# EAGLE design EBN_FMRX_V02 (EAGLE 7.3.0)
CNAME: EasyBoard Nano; CREVISION: 0.1; DESIGNER: Martin Olejar
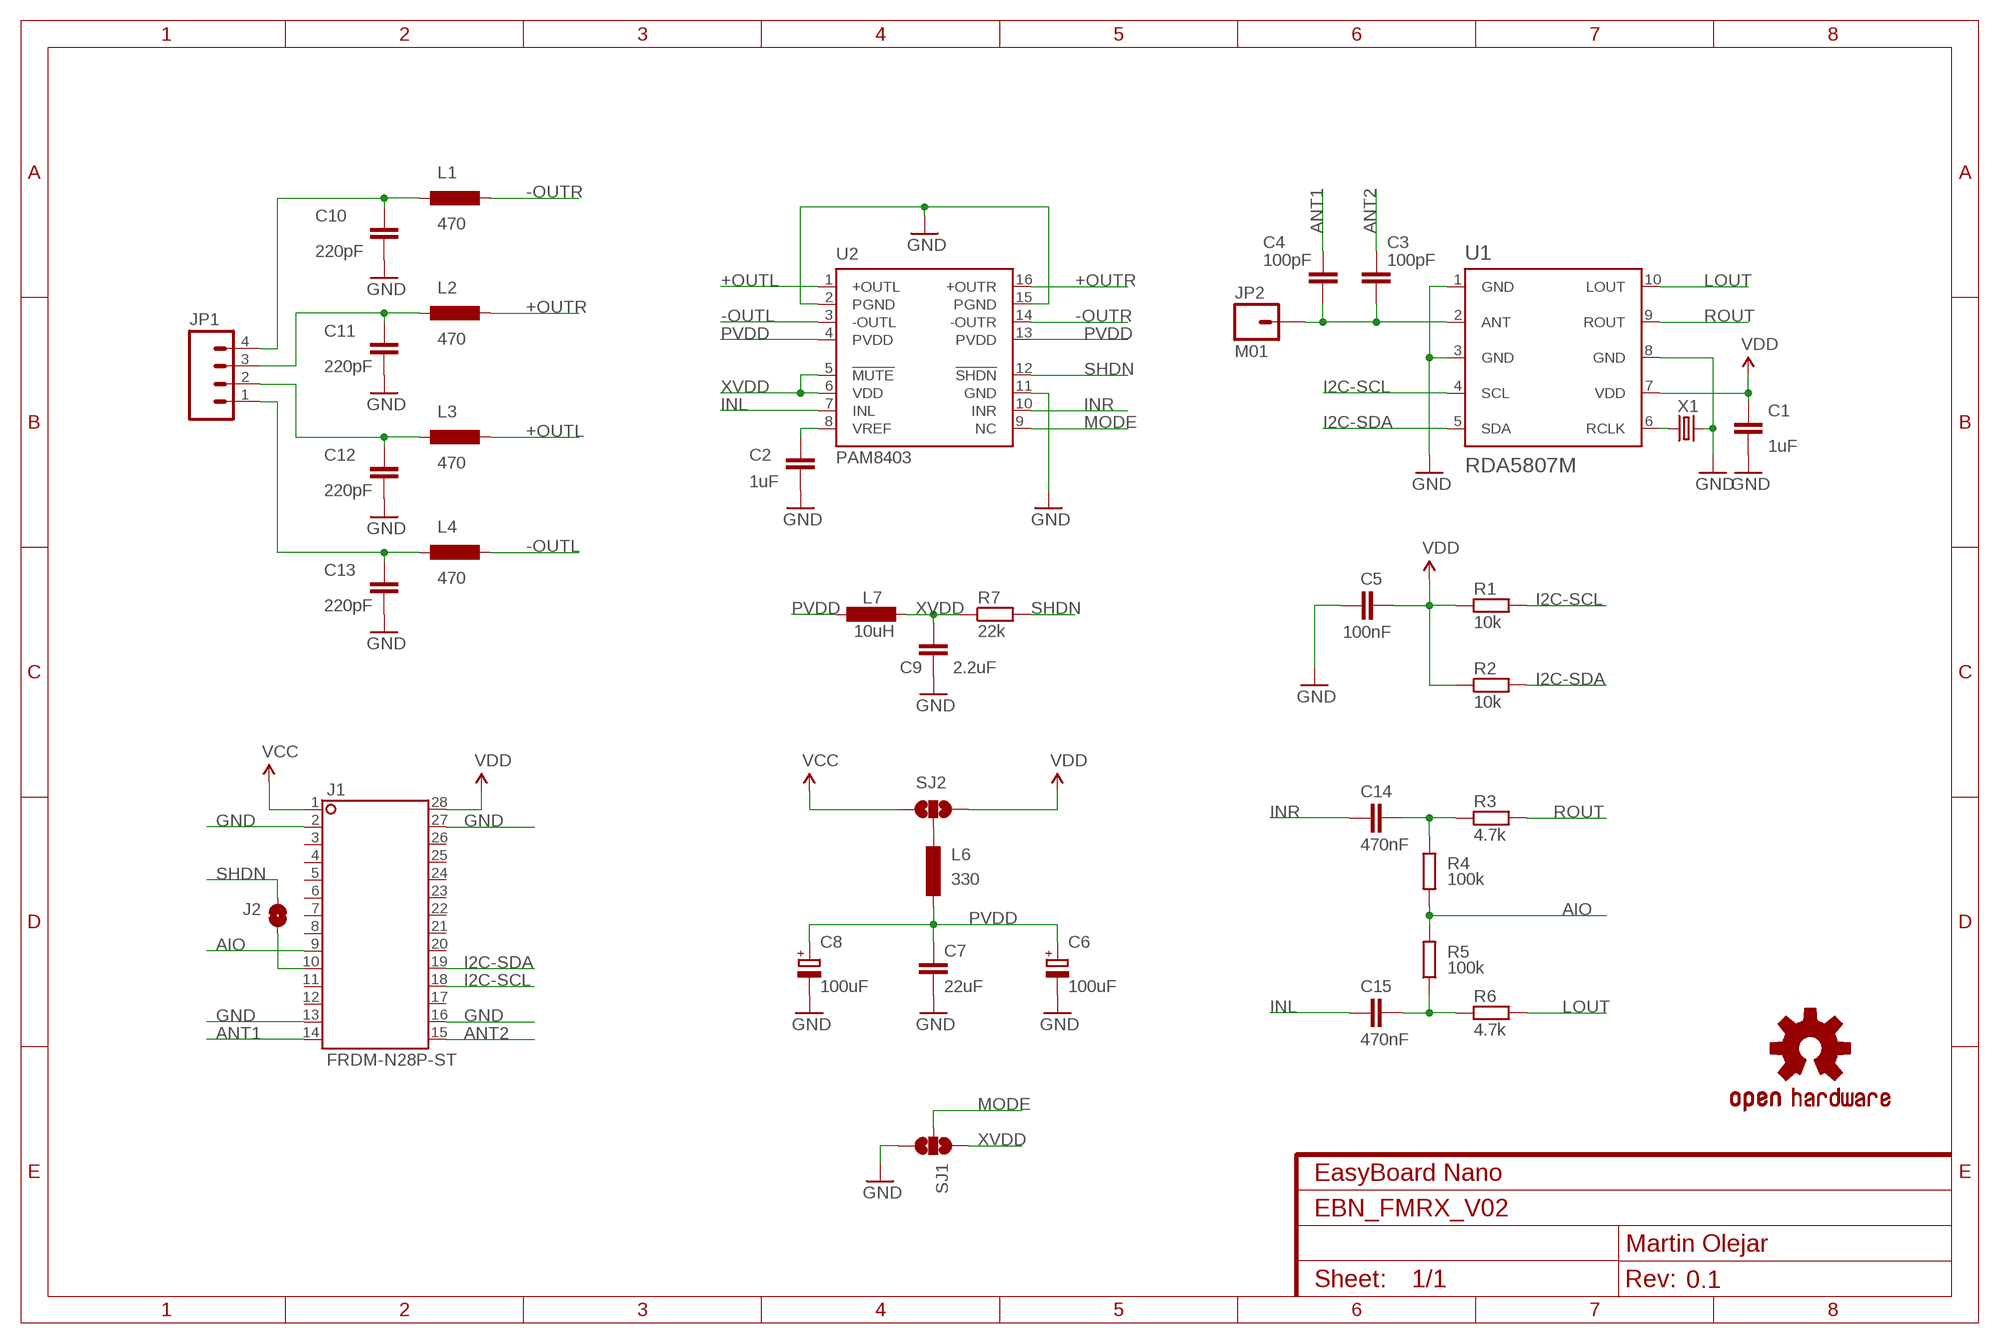
[diagram p0: schematic, sheet 1]

## Parts
C1  1uF  C-EUC0603  [C0603]
C2  1uF  C-EUC0603  [C0603]
C3  100pF  C-EUC0603  [C0603]
C4  100pF  C-EUC0603  [C0603]
C5  100nF  C-EUC0603  [C0603]
C6  100uF  CPOL-EUSMCC  [SMC_C]
C7  22uF  C-EUC1206  [C1206]
C8  100uF  CPOL-EUSMCC  [SMC_C]
C9  2.2uF  C-EUC0603  [C0603]
C10  220pF  C-EUC0603  [C0603]
C11  220pF  C-EUC0603  [C0603]
C12  220pF  C-EUC0603  [C0603]
C13  220pF  C-EUC0603  [C0603]
C14  470nF  C-EUC0603  [C0603]
C15  470nF  C-EUC0603  [C0603]
J1  FRDM-N28P-ST  [FRDM-N28P-SHIELD]
J2  SJ-S  [JUMPER-SMD-S1X]
JP1  M04SMD_1.25MM  [1X04-1.25MM_SMD]
JP2  M01  [1X01-EXTRA]
L1  470  L-EUL0805  [L0805]
L2  470  L-EUL0805  [L0805]
L3  470  L-EUL0805  [L0805]
L4  470  L-EUL0805  [L0805]
L6  330  L-EUL0805  [L0805]
L7  10uH  L-EUL0805  [L0805]
LOGO1  OSHW-LOGOS  [OSHW-LOGO-S]
R1  10k  R-EUR0603  [R0603]
R2  10k  R-EUR0603  [R0603]
R3  4.7k  R-EUR0603  [R0603]
R4  100k  R-EUR0603  [R0603]
R5  100k  R-EUR0603  [R0603]
R6  4.7k  R-EUR0603  [R0603]
R7  22k  R-EUR0603  [R0603]
SJ1  SJ2W-S  [JUMPER-SMD-S2X]
SJ2  SJ2W-S  [JUMPER-SMD-S2X]
U1  RDA5807M  [MSOP10]
U2  PAM8403  [SO16]
X1  XTAL1-SMD-2P-3.2X1.5MM  [SMD-2X-3215]

## Nets
+OUTL: L3.2 U2.1(+OUTL)
+OUTR: L2.2 U2.16(+OUTR)
-OUTL: L4.2 U2.3(-OUTL)
-OUTR: L1.2 U2.14(-OUTR)
AIO: J1.9 R4.2 R5.2
ANT1: C4.1 J1.14
ANT2: C3.1 J1.15
GND: C1.1 C2.2 C5.2 C6.- C7.1 C8.- C9.1 C10.1 C11.1 C12.1 C13.1 J1.2 J1.13 J1.16 J1.27 SJ1.3 U1.1(GND) U1.3(GND) U1.8(GND) U2.2(PGND) U2.11(GND) U2.15(PGND) X1.2
I2C-SCL: J1.18 R1.2 U1.4(SCL)
I2C-SDA: J1.19 R2.2 U1.5(SDA)
INL: C15.2 U2.7(INL)
INR: C14.2 U2.10(INR)
LOUT: R6.2 U1.10(LOUT)
MODE: SJ1.2 U2.9(NC)
N$1: C2.1 U2.8(VREF)
N$2: C10.2 JP1.4 L1.1
N$3: C3.2 C4.2 JP2.P$1 U1.2(ANT)
N$4: C11.2 JP1.3 L2.1
N$5: C12.2 JP1.2 L3.1
N$6: U1.6(RCLK) X1.1
N$7: J1.10 J2.1
N$9: C13.2 JP1.1 L4.1
N$11: L6.2 SJ2.2
N$16: C14.1 R3.1 R4.1
N$17: C15.1 R5.1 R6.1
PVDD: C6.+ C7.2 C8.+ L6.1 L7.1 U2.4(PVDD) U2.13(PVDD)
ROUT: R3.2 U1.9(ROUT)
SHDN: J2.2 R7.2 U2.12(!SHDN)
VCC: J1.1 SJ2.1
VDD: C1.2 C5.1 J1.28 R1.1 R2.1 SJ2.3 U1.7(VDD)
XVDD: C9.2 L7.2 R7.1 SJ1.1 U2.5(!MUTE) U2.6(VDD)
Unconnected: J1.3 J1.4 J1.5 J1.6 J1.7 J1.8 J1.11 J1.12 J1.17 J1.20 J1.21 J1.22 J1.23 J1.24 J1.25 J1.26

## Library data of the parts
C1-C5 C7 C9-C15 = atomx_RLC:C-EU: CAPACITOR, European symbol
C6 C8 = atomx_RLC:CPOL-EU: POLARIZED CAPACITOR, European symbol
J1 = atomx_Boards:FRDM-N28P: Dual In Line
J2 = atomx_Connectors:SJ: SMD solder JUMPER
JP1 = atomx_Connectors:M04: Header 4 Standard 4-pin 0.1" header. Use with straight break away headers (SKU : PRT-00116), right angle break away headers (PRT-00553), swiss pins (PRT-00743), machine pins (PRT-00117), and female headers (PRT-00115). Molex polarized connector foot print use with SKU : PRT-08231 with associated crimp pins and housings. 1MM SMD Version SKU: PRT-10208
JP2 = atomx_Connectors:M01: Header 1 Standard 1-pin 0.1" header. Use with straight break away headers (SKU : PRT-00116), right angle break away headers (PRT-00553), swiss pins (PRT-00743), machine pins (PRT-00117), and female headers (PRT-00115).
L1-L4 L6 L7 = atomx_RLC:L-EU: INDUCTOR, European symbol
LOGO1 = atomx_Common:OSHW-LOGO: Open Source Hardware Logo This logo indicates the piece of hardware it is found on incorporates a OSHW license and/or adheres to the definition of open source hardware found here: http://freedomdefined.org/OSHW
R1-R7 = atomx_RLC:R-EU: RESISTOR, European symbol
SJ1 SJ2 = atomx_Connectors:SJ2W: SMD solder JUMPER
U1 = atomx_IC:RDA5807M
U2 = atomx_IC:PAM8403
X1 = atomx_Xtals:XTAL1

## Board
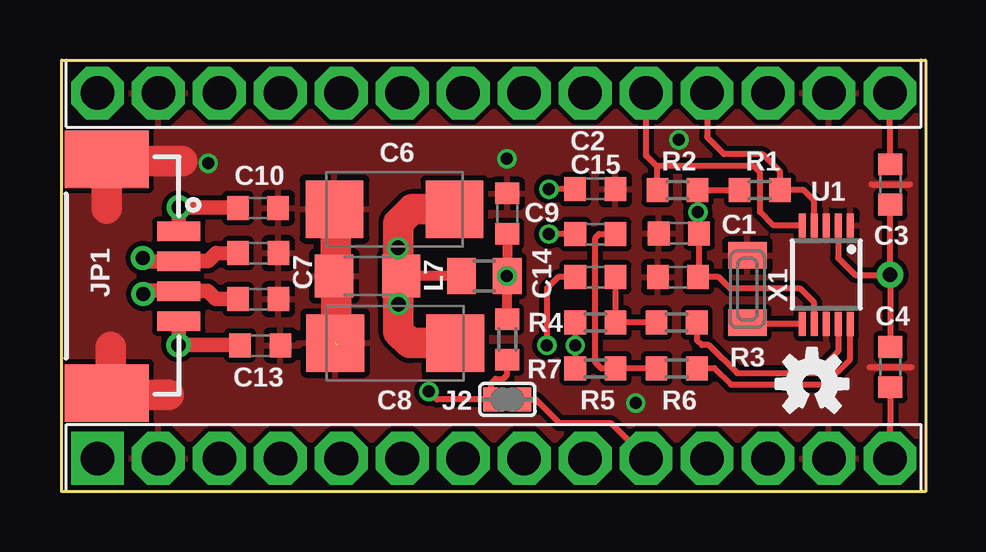
[diagram p1: board, top side]
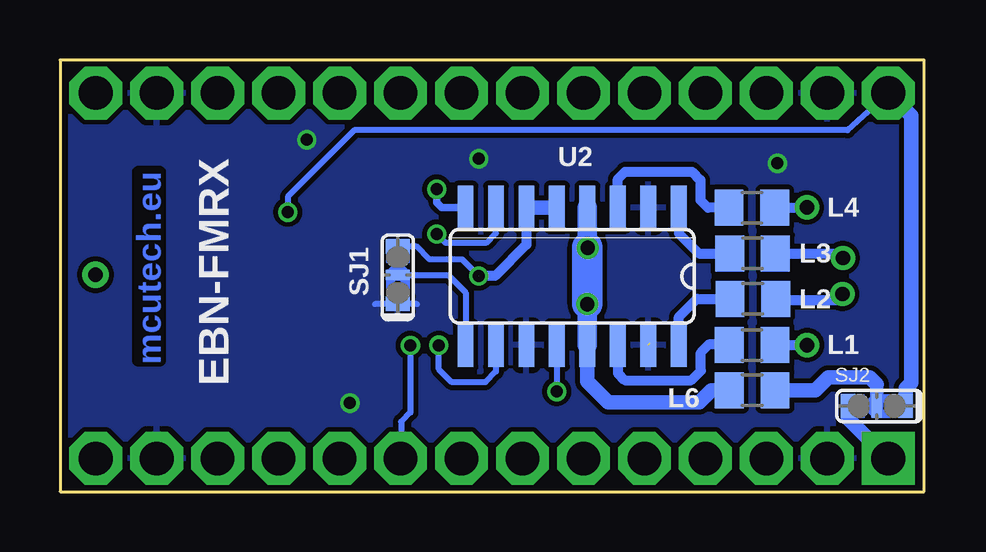
[diagram p2: board, bottom side, seen from below]

Size 36 x 18 mm. Coordinates in mm from the lower left corner, seen from the top.
Copper layers (1*16): Top 0.035mm / dielectric 1.5mm / Bottom 0.035mm
Design rules "ITEADstudio_DRC *": minimum track width 6mil, minimum drill 12mil, track to track 8mil, track to pad 8mil, pad to pad 8mil, via to via 8mil, smd to smd 0mil, copper to edge 10mil, drill to drill 10mil, minimum pad ring 10mil, minimum via ring 6mil, stop-mask expansion 2mil, vias tented up to drill 100mil, thermal gap 10mil

### Footprints (pad centres in the part's own frame; a part is rotated, then mirrored left to right if it is on the bottom)
C0603 = smd 0.9 x 1: 1 -0.84,0; 2 0.84,0
SMC_C = smd 2.4 x 2.4: + -2.5,0; - 2.5,0
C1206 = smd 1.6 x 1.8: 1 -1.4,0; 2 1.4,0
FRDM-N28P-SHIELD = drill 1.4 pad 2.2 square: 1 -16.51,-7.62 | drill 1.4 pad 2.2 octagon: 2 -13.97,-7.62; 3 -11.43,-7.62; 4 -8.89,-7.62; 5 -6.35,-7.62; 6 -3.81,-7.62; 7 -1.27,-7.62; 8 1.27,-7.62; 9 3.81,-7.62; 10 6.35,-7.62; 11 8.89,-7.62; 12 11.43,-7.62; 13 13.97,-7.62; 14 16.51,-7.62; 15 16.51,7.62; 16 13.97,7.62; 17 11.43,7.62; 18 8.89,7.62; 19 6.35,7.62; 20 3.81,7.62; 21 1.27,7.62; 22 -1.27,7.62; 23 -3.81,7.62; 24 -6.35,7.62; 25 -8.89,7.62; 26 -11.43,7.62; 27 -13.97,7.62; 28 -16.51,7.62
JUMPER-SMD-S1X = smd 0.6 x 1: 1 -0.7,0; 2 0.7,0
1X04-1.25MM_SMD = smd 0.8 x 1.8: 1 0,0; 2 1.25,0; 3 2.5,0; 4 3.75,0 | smd 2.4 x 3.5: P$5 -3,-3; P$6 6.75,-3
1X01-EXTRA = drill 0.6: P$1 0,0
L0805 = smd 1.2 x 1.5: 1 -0.95,0; 2 0.95,0
R0603 = smd 0.9 x 1: 1 -0.84,0; 2 0.84,0
JUMPER-SMD-S2X = smd 0.6 x 1: 1 -1.2,0; 3 1.2,0 | smd 0.4 x 1: 2 0,0
MSOP10 = smd 0.3 x 1: 1 -1,-2.05; 2 -0.5,-2.05; 3 0,-2.05; 4 0.5,-2.05; 5 1,-2.05; 6 1,2.05; 7 0.5,2.05; 8 0,2.05; 9 -0.5,2.05; 10 -1,2.05
SO16 = smd 0.66 x 1.8: 1 -4.445,-2.873; 2 -3.175,-2.873; 3 -1.905,-2.873; 4 -0.635,-2.873; 5 0.635,-2.873; 6 1.905,-2.873; 7 3.175,-2.873; 8 4.445,-2.873; 9 4.445,2.873; 10 3.175,2.873; 11 1.905,2.873; 12 0.635,2.873; 13 -0.635,2.873; 14 -1.905,2.873; 15 -3.175,2.873; 16 -4.445,2.873
SMD-2X-3215 = smd 1.1 x 1.6: 1 -1.4,0; 2 1.4,0

### Placement (x,y rotation side)
C1  25.72,10.77 0 top
C2  22.23,12.61 0 top
C3  34.53,12.81 270 top
C4  34.53,5.19 90 top
C5  25.68,8.94 180 top
C6  13.87,11.78 180 top
C7  12.75,8.99 0 top
C8  13.9,6.19 180 top
C9  18.56,11.59 270 top
C10  8.27,6.1 180 top
C11  8.19,8.03 180 top
C12  8.19,9.94 180 top
C13  8.18,11.83 180 top
C14  22.24,8.94 180 top
C15  22.24,10.73 180 top
J1  18,9 0 top
J2  18.57,3.84 180 top
JP1  4.88,10.86 270 top
JP2  34.52,9.04 0 top
L1  7.16,6.11 180 bottom
L2  7.13,8.04 180 bottom
L3  7.14,9.93 180 bottom
L4  7.17,11.84 180 bottom
L6  7.16,4.22 0 bottom
L7  17.61,8.99 0 top
LOGO1  31.26,4.49 0 top
R1  29.09,12.58 0 top
R2  25.66,12.58 180 top
R3  25.62,7.05 0 top
R4  22.24,7.05 180 top
R5  22.24,5.14 180 top
R6  25.63,5.14 0 top
R7  18.56,6.34 270 top
SJ1  21.92,9.03 270 bottom
SJ2  1.97,3.57 0 bottom
U1  31.86,9.05 180 top
U2  14.66,8.98 180 bottom
X1  28.57,8.45 90 top

### Tracks (layer width: path | path; a pad name or v marks a point on that pad's centre or on a via)
+OUTL
  Bottom 0.406: U2.1 10.21,10.77 9.38,9.93 L3.2
+OUTR
  Bottom 0.406: 8.27,8.01 L2.2 9.46,8.04 10.21,7.29 U2.16
-OUTL
  Bottom 0.406: U2.3 12.75,13.04 12.45,13.34 9.66,13.34 9.32,13 9.32,12.15 9.01,11.84 8.22,11.84 L4.2
-OUTR
  Bottom 0.406: U2.14 12.75,4.95 12.46,4.64 9.7,4.64 9.3,5.04 9.3,5.8 8.97,6.13 8.22,6.13 L1.2
AIO  (via drill 0.5)
  Top 0.254: R4.2 21.4,6.13 v21.4,6.09 R5.2
  Bottom 0.254: v21.4,6.09 21.4,3.3 21.79,2.91 21.79,1.4 J1.9
ANT1
  Top 0.254: C4.1 J1.14
ANT2
  Top 0.254: C3.1 J1.15
GND  (via drill 0.5)  (1 unrouted)
  Top 0.254: 33.65,5.19 35.4,5.19 | 33.75,12.81 35.34,12.81 35.34,12.82
  Top 0.813: 4.47,4.03 4.47,4.04 | 2.11,4.13 2.05,4.13 | 1.86,14.13 1.88,14.13
  Top 1.27: 1.94,4.03 4.47,4.03 | 2.05,4.13 2.05,6.03 | 1.88,14.13 1.88,11.81 | 1.96,13.79 5.03,13.79 | 11.43,11.49 11.45,6.26
  Bottom 0.254: 21.13,7.82 22.87,7.82
  other vias: 23.92,3.69 6.11,13.69 25.72,14.67 18.55,13.88
  pour Top: 0.15,17.99 36.15,17.99 36.15,0.02 0.15,0.02
  pour Bottom: 0.15,17.98 36.02,17.98 36.02,0.02 0.15,0.02
I2C-SCL
  Top 0.254: U1.4 31.36,12.13 30.91,12.58 R1.2 29.94,13.34 29.21,14.07 27.61,14.07 26.89,14.79 J1.18
I2C-SDA
  Top 0.254: U1.5 29.65,11.1 29.1,11.65 29.1,13.3 28.83,13.57 24.79,13.57 | 24.95,12.72 R2.2 24.79,12.58 24.79,13.57 | 24.79,13.57 24.35,14.01 J1.19
INL  (via drill 0.5)
  Top 0.254: C15.2 v20.31,10.73 v20.3,10.74
  Bottom 0.254: U2.7 17.84,12.05 17.84,10.78 18.25,10.37 19.93,10.37 v20.3,10.74
INR  (via drill 0.5)
  Top 0.254: C14.2 20.69,8.94 20.22,8.47 v20.22,6.1
  Bottom 0.254: 17.84,5.91 U2.10 17.83,5 18.28,4.56 19.67,4.56 20.21,5.1 v20.21,6.09 v20.22,6.1
LOUT
  Top 0.254: U1.10 32.85,6.86 32.85,5.49 31.82,4.46 27.88,4.46 27.2,5.14 R6.2 26.49,5.16
MODE
  Bottom 0.254: SJ1.2 19.83,9.03 19.1,8.3 U2.9
N$1  (via drill 0.5)
  Top 0.254: C2.1 v20.3,12.61
  Bottom 0.305: U2.8 20.09,11.85 20.3,12.06 v20.3,12.61
N$2  (via drill 0.6 pad 1.02)
  Top 0.61: C10.2 7.41,6.11 v4.87,6.11 4.88,6.12 JP1.4
  Bottom 0.406: L1.1 v4.87,6.11
N$3
  Top 0.254: U1.2 32.36,9.74 33.06,9.04 JP2.P$1 | JP2.P$1 34.52,11.95 C3.2 | JP2.P$1 34.52,6.05 C4.2
N$4  (via drill 0.6 pad 1.02)
  Top 0.406: 5.07,8.38 JP1.3
  Top 0.61: 5.07,8.38 3.54,8.38 v3.4,8.24 | C11.2 7.33,8.04 6.41,8.04 6.09,8.36 JP1.3
  Bottom 0.406: L2.1 6.27,8 | 6.27,8 6.22,8.05 | 6.27,8 3.64,8 v3.4,8.24
N$5  (via drill 0.6 pad 1.02)
  Top 0.406: 5.07,9.59 JP1.2
  Top 0.61: 5.07,9.59 3.58,9.59 v3.38,9.74 | C12.2 7.33,9.93 6.43,9.94 6.11,9.62 JP1.2
  Bottom 0.406: L3.1 3.52,9.93 v3.38,9.74
N$6
  Top 0.254: U1.6 28.8,7 X1.1
N$7
  Top 0.254: J2.1 19.76,3.84 20.74,2.86 22.87,2.86 J1.10
N$9  (via drill 0.6 pad 1.02)
  Top 0.406: 5.01,10.9 JP1.1
  Top 0.61: C13.2 7.31,11.85 v4.88,11.85 4.88,11.03 5.01,10.9
  Bottom 0.406: L4.1 4.89,11.84 v4.88,11.85
N$11
  Bottom 0.56: 1.97,4.46 SJ2.2
  Bottom 0.61: L6.2 4.54,4.22 4,4.76 2.27,4.76 1.97,4.46
N$16
  Top 0.254: R3.1 R4.1 C14.1 23.09,8.76
N$17
  Top 0.254: C15.1 23.13,10.74 22.39,10.74 22.24,10.59 22.24,5.38 22.49,5.13 R5.1 R6.1
PVDD  (via drill 0.6)
  Top 0.254: 14.02,6.66 14.02,7.79 v14.03,7.82
  Top 0.406: L7.1 C7.2
  Top 1.016: 14.02,9.12 C7.2 14.02,8.87
  Top 1.27: C6.+ 14.6,11.78 14.02,11.2 14.02,9.12 | C8.+ 14.5,6.19 14.02,6.66 14.02,8.87
  Bottom 0.406: 14.02,10.21 v14.01,10.16 14.03,10.2 | 14.02,7.78 v14.03,7.82 | 14.03,5.9 U2.13
  Bottom 0.61: 14.03,5.9 14.03,4.59 13.16,3.72 9.36,3.72 8.86,4.22 L6.1
  Bottom 0.813: U2.4 14.02,10.21 | U2.13 14.02,7.78
  Bottom 1.27: v14.03,7.82 14.03,10.2
ROUT
  Top 0.254: U1.9 32.36,5.85 31.45,4.94 28.14,4.94 26.97,6.11 26.67,6.11 26.47,6.31 R3.2
SHDN  (via drill 0.5)
  Top 0.254: 18.56,5.18 R7.2 18.56,4.87 18.39,4.7 18.08,4.7 17.87,4.49 J2.2 15.63,3.84 v15.3,4.17
  Bottom 0.254: U2.12 v15.29,4.17 v15.3,4.17
VCC
  Bottom 0.61: SJ2.1 3.17,3.06 J1.1
VDD  (via drill 0.5)
  Top 0.254: 26.58,8.73 C5.1 | R1.1 R2.1 v26.51,11.65 26.51,10.83 C1.2 26.56,8.99 C5.1 | U1.7 31.36,7.88 30.78,8.46 27.86,8.46 27.38,8.94 C5.1
  Bottom 0.254: J1.28 3.19,15.07 23.74,15.07 26.51,12.3 v26.51,11.65
  Bottom 0.61: SJ2.3 0.77,4.31 0.54,4.54 0.54,15.67 J1.28
XVDD  (via drill 0.5)  (1 unrouted)
  Top 0.406: C9.2 L7.2 v18.55,8.99 L7.2 R7.1
  Bottom 0.254: SJ1.1 21.16,10.23 20.61,9.68 19.24,9.68 v18.55,8.99
  Bottom 0.406: U2.6 16.56,10.29 17.87,8.99 v18.55,8.99
  Bottom 0.61: U2.5 U2.6

### Text on the board
Bottom: mcutech.eu
tPlace: C10 | C13
bPlace: EBN-FMRX